# Altium schematic sheet LED-PCB_DIG2.SchDoc
size B; SheetNumber: 4; SheetTotal: 5
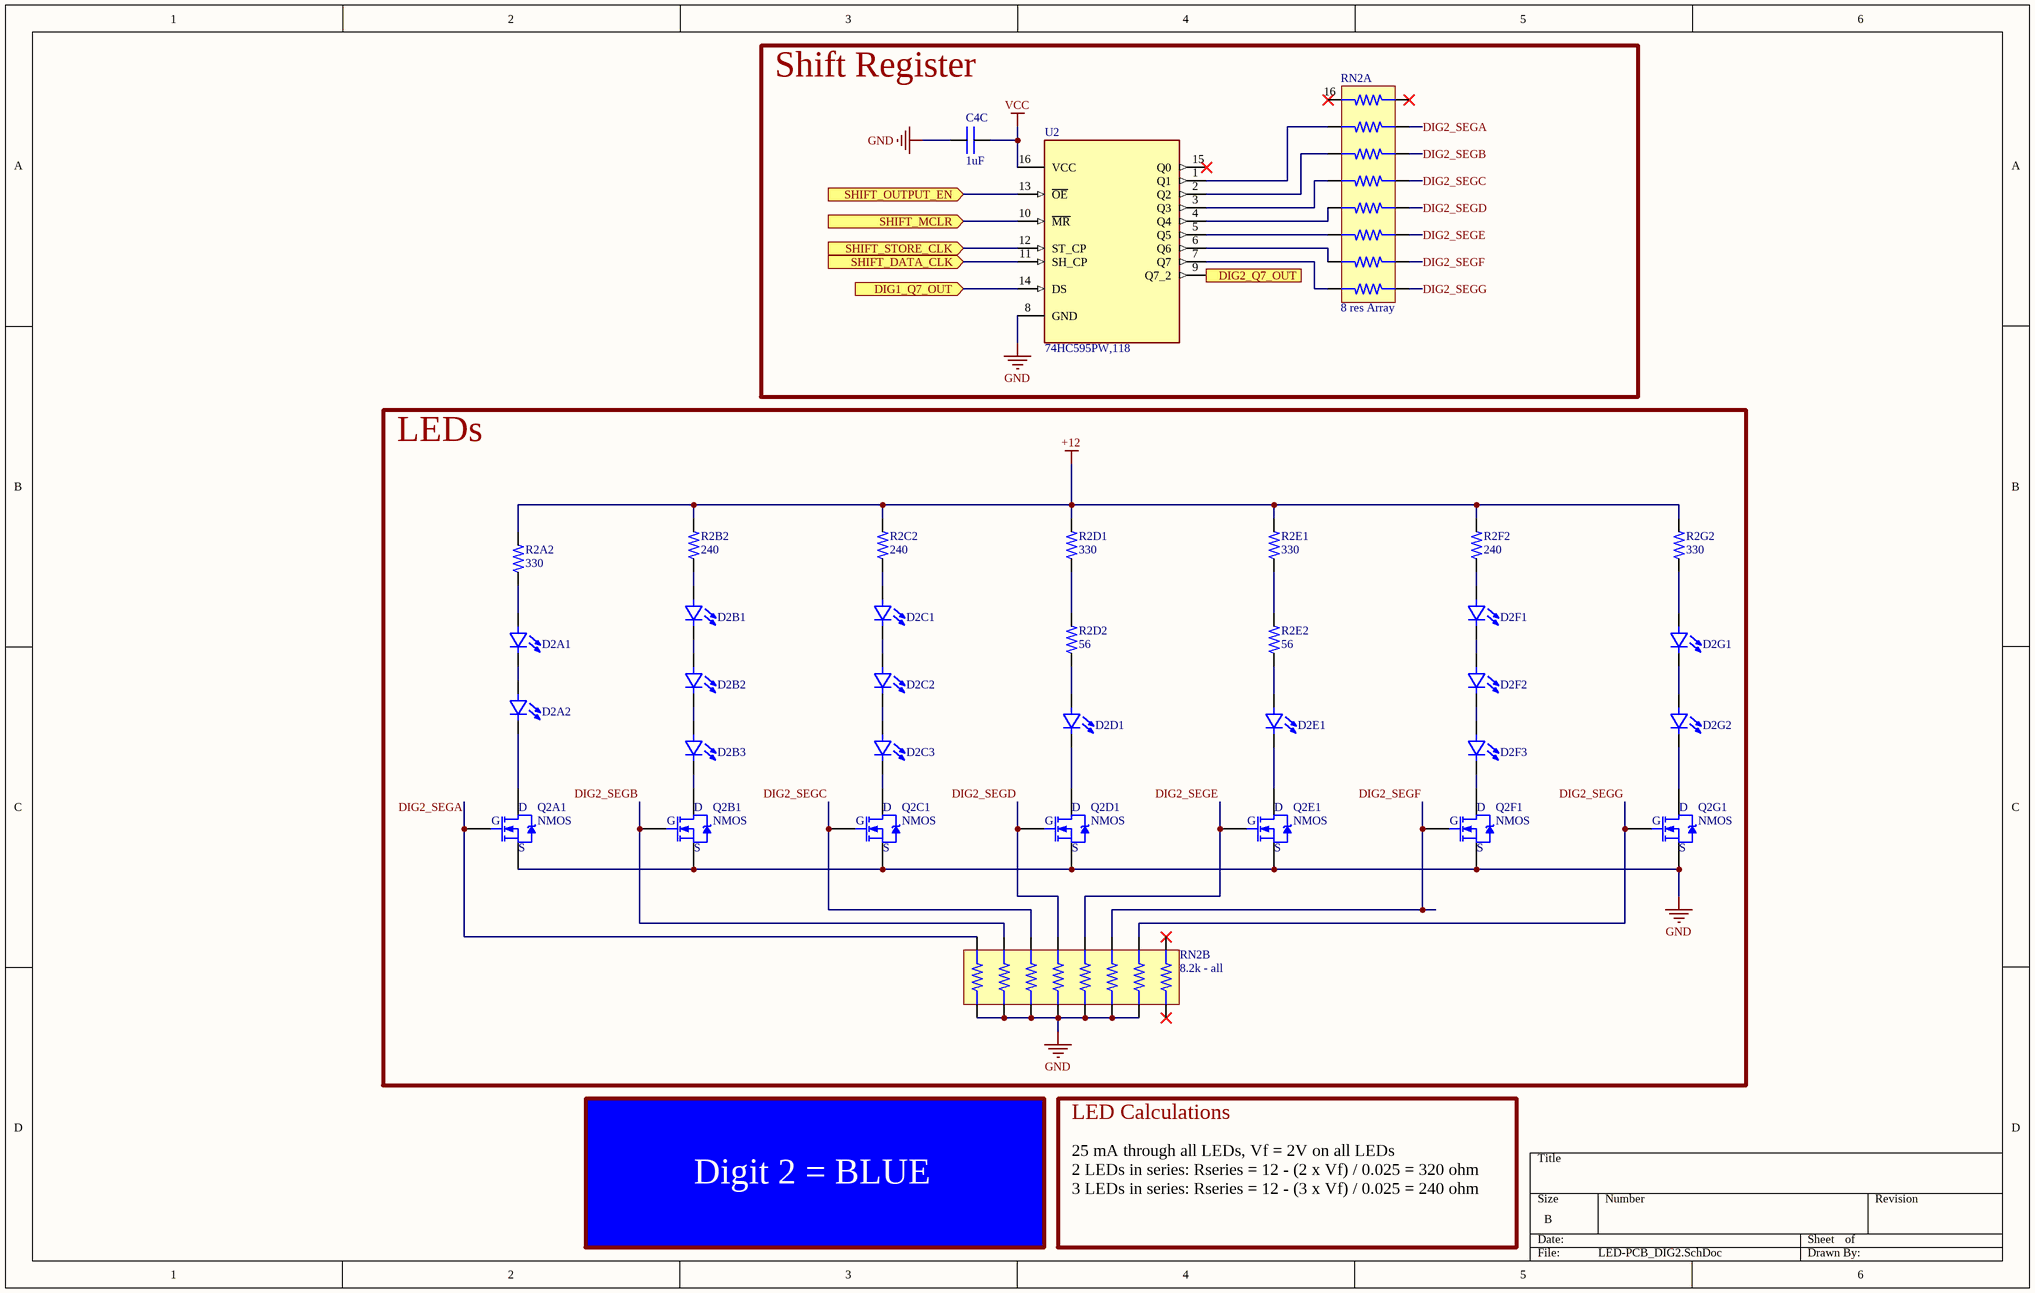
[diagram p0: LED-PCB_DIG2.SchDoc]

## Parts
C4C  value 1uF  [0402 CAP]  (hidden comment: CAP)
D2A1  LED - single  [LED - 0603]  (value not drawn)
D2A2  LED - single  [LED - 0603]  (value not drawn)
D2B1  LED - single  [LED - 0603]  (value not drawn)
D2B2  LED - single  [LED - 0603]  (value not drawn)
D2B3  LED - single  [LED - 0603]  (value not drawn)
D2C1  LED - single  [LED - 0603]  (value not drawn)
D2C2  LED - single  [LED - 0603]  (value not drawn)
D2C3  LED - single  [LED - 0603]  (value not drawn)
D2D1  LED - single  [LED - 0603]  (value not drawn)
D2E1  LED - single  [LED - 0603]  (value not drawn)
D2F1  LED - single  [LED - 0603]  (value not drawn)
D2F2  LED - single  [LED - 0603]  (value not drawn)
D2F3  LED - single  [LED - 0603]  (value not drawn)
D2G1  LED - single  [LED - 0603]  (value not drawn)
D2G2  LED - single  [LED - 0603]  (value not drawn)
Q2A1  NMOS  [SOT-23]
Q2B1  NMOS  [SOT-23]
Q2C1  NMOS  [SOT-23]
Q2D1  NMOS  [SOT-23]
Q2E1  NMOS  [SOT-23]
Q2F1  NMOS  [SOT-23]
Q2G1  NMOS  [SOT-23]
R2A2  value 330  [0402 RES]  (hidden comment: RES)
R2B2  value 240  [0402 RES]  (hidden comment: RES)
R2C2  value 240  [0402 RES]  (hidden comment: RES)
R2D1  value 330  [0402 RES]  (hidden comment: RES)
R2D2  value 56  [0402 RES]  (hidden comment: RES)
R2E1  value 330  [0402 RES]  (hidden comment: RES)
R2E2  value 56  [0402 RES]  (hidden comment: RES)
R2F2  value 240  [0402 RES]  (hidden comment: RES)
R2G2  value 330  [0402 RES]  (hidden comment: RES)
RN2A  8 res Array  [EXB2HV331JV]
RN2B  8.2k - all  [MNR18ERAPJ822]
U2  74HC595PW,118  [16-TSSOP]

## Blocks framed on the sheet
Shift Register: C4C RN2A U2
LEDs: D2A1 D2A2 D2B1-D2B3 D2C1-D2C3 D2D1 D2E1 D2F1-D2F3 D2G1 D2G2 Q2A1 Q2B1 Q2C1 Q2D1 Q2E1 Q2F1 Q2G1 R2A2 R2B2 R2C2 R2D1 R2D2 R2E1 R2E2 R2F2 R2G2 RN2B

## Ports
DIG1_Q7_OUT (in, see LED-PCB_Master[3A], LED-PCB_DIG1[4A]), DIG2_Q7_OUT (out, see LED-PCB_Master[3B], LED-PCB_DIG3[2B]), SHIFT_DATA_CLK (in, see LED-PCB_Master[3A], LED-PCB_DIG0[3A], LED-PCB_DIG1[3A], LED-PCB_DIG3[2B]), SHIFT_MCLR (in, see LED-PCB_Master[3A], LED-PCB_DIG0[3A], LED-PCB_DIG1[3A], LED-PCB_DIG3[2B]), SHIFT_OUTPUT_EN (in, see LED-PCB_Master[3B], LED-PCB_DIG0[3A], LED-PCB_DIG1[3A], LED-PCB_DIG3[2B]), SHIFT_STORE_CLK (in, see LED-PCB_Master[3A], LED-PCB_DIG0[3A], LED-PCB_DIG1[3A], LED-PCB_DIG3[2B])

## Nets
+12: R2A2.2 R2B2.2 R2C2.2 R2D1.2 R2E1.2 R2F2.2 R2G2.2
GND: C4C.1 Q2A1.2(S) Q2B1.2(S) Q2C1.2(S) Q2D1.2(S) Q2E1.2(S) Q2F1.2(S) Q2G1.2(S) RN2B.1 RN2B.2 RN2B.3 RN2B.4 RN2B.5 RN2B.6 RN2B.7 U2.8(GND)
VCC: C4C.2 U2.16(VCC)
DIG1_Q7_OUT: U2.14(DS) ; port DIG1_Q7_OUT
DIG2_Q7_OUT: U2.9(Q7_2) ; port DIG2_Q7_OUT
DIG2_SEGA: Q2A1.1(G) RN2A.2 RN2B.16
DIG2_SEGB: Q2B1.1(G) RN2A.3 RN2B.15
DIG2_SEGC: Q2C1.1(G) RN2A.4 RN2B.14
DIG2_SEGD: Q2D1.1(G) RN2A.5 RN2B.13
DIG2_SEGE: Q2E1.1(G) RN2A.6 RN2B.12
DIG2_SEGF: Q2F1.1(G) RN2A.7 RN2B.11
DIG2_SEGG: Q2G1.1(G) RN2A.8 RN2B.10
SHIFT_DATA_CLK: U2.11(SH_CP) ; port SHIFT_DATA_CLK
SHIFT_MCLR: U2.10(~{MR}) ; port SHIFT_MCLR
SHIFT_OUTPUT_EN: U2.13(~{OE}) ; port SHIFT_OUTPUT_EN
SHIFT_STORE_CLK: U2.12(ST_CP) ; port SHIFT_STORE_CLK
NetD2A1_1: D2A1.1(A) R2A2.1
NetD2A1_2: D2A1.2(C) D2A2.1(A)
NetD2A2_2: D2A2.2(C) Q2A1.3(D)
NetD2B1_1: D2B1.1(A) R2B2.1
NetD2B1_2: D2B1.2(C) D2B2.1(A)
NetD2B2_2: D2B2.2(C) D2B3.1(A)
NetD2B3_2: D2B3.2(C) Q2B1.3(D)
NetD2C1_1: D2C1.1(A) R2C2.1
NetD2C1_2: D2C1.2(C) D2C2.1(A)
NetD2C2_2: D2C2.2(C) D2C3.1(A)
NetD2C3_2: D2C3.2(C) Q2C1.3(D)
NetD2D1_1: D2D1.1(A) R2D2.1
NetD2D1_2: D2D1.2(C) Q2D1.3(D)
NetD2E1_1: D2E1.1(A) R2E2.1
NetD2E1_2: D2E1.2(C) Q2E1.3(D)
NetD2F1_1: D2F1.1(A) R2F2.1
NetD2F1_2: D2F1.2(C) D2F2.1(A)
NetD2F2_2: D2F2.2(C) D2F3.1(A)
NetD2F3_2: D2F3.2(C) Q2F1.3(D)
NetD2G1_1: D2G1.1(A) R2G2.1
NetD2G1_2: D2G1.2(C) D2G2.1(A)
NetD2G2_2: D2G2.2(C) Q2G1.3(D)
NetR2D1_1: R2D1.1 R2D2.2
NetR2E1_1: R2E1.1 R2E2.2
NetRN2A_9: RN2A.9 U2.7(Q7)
NetRN2A_10: RN2A.10 U2.6(Q6)
NetRN2A_11: RN2A.11 U2.5(Q5)
NetRN2A_12: RN2A.12 U2.4(Q4)
NetRN2A_13: RN2A.13 U2.3(Q3)
NetRN2A_14: RN2A.14 U2.2(Q2)
NetRN2A_15: RN2A.15 U2.1(Q1)

Not connected (* = marked no-connect by the designer): RN2A 1* 16*; RN2B 8* 9*; U2 15(Q0)*

## Notes on the sheet
- LED Calculations
- Digit 2 = BLUE
- 25 mA through all LEDs, Vf = 2V on all LEDs
  2 LEDs in series: Rseries = 12 - (2 x Vf) / 0.025 = 320 ohm
  3 LEDs in series: Rseries = 12 - (3 x Vf) / 0.025 = 240 ohm

## Library data of the parts
C4C = CAP: Capaicitor; MFR PN: CL05A105KP5NNNC; MFR: Samsung Microelectronics
D2A1 D2A2 D2B1-D2B3 D2C1-D2C3 D2D1 D2E1 D2F1-D2F3 D2G1 D2G2 = LED - single: MFR PN: 150060RS75000; MFR: Wurth Elektronik; Color: Red
Q2A1 Q2B1 Q2C1 Q2D1 Q2E1 Q2F1 Q2G1 = NMOS: N-Channel MOSFET; MFR PN: DMN63D8L-7; MFR: Diodes Incorporated
R2A2 R2D1 R2E1 R2G2 = RES: Resistor; MFR PN: RC0402JR-13330RL; MFR: YAGEO
R2B2 R2C2 R2F2 = RES: Resistor; MFR PN: RC0402FR-07240RL; MFR: YAGEO
R2D2 R2E2 = RES: Resistor; Part Number: RC0402FR-0756RL
RN2A = 8 res Array: MFR PN: EXB-2HV331JV; MFR: Panasonic Microelectronics; Value: 330; Vendor: *; Vendor PN: *; ComponentLink1Description: New link; ComponentLink1URL: *; ComponentLink2Description: New link 1; ComponentLink2URL: *; Vendor Link: *
RN2B = MNR18ERAPJ822: 8.2k Ohm ±5% 62.5mW Power Per Element Isolated 8 Resistor Network/Array ±250ppm/°C 1606, Convex, Long Side Terminals; MFR: Rohm Semiconductor; MFR PN: MNR18ERAPJ822
U2 = 74HC595PW,118: Shift Shift Register 1 Element 8 Bit 16-TSSOP; MFR PN: 74HC595PW,118; Nexperia USA: *